# Altium schematic sheet 1_P1.schdoc
size 426 x 304 mm; Symbol: Sheet-Symbol_A3; Device: Sheet-Symbol_A3; Convert to PCB: yes; Add into BOM: yes; @Project Name: Catch5Yeah; @Page Count: 1; @Update Date: 2022-01-23; @Create Date: 2021-12-05; @Schematic Name: Schematic1; Company: 深圳嘉立创科技发展有限公司; Drawed: 嘉立创EDA; Reviewed: 嘉立创EDA; Version: V0.1; Page Size: A3; Part Number: JLCPCB-001; @Page No: 1
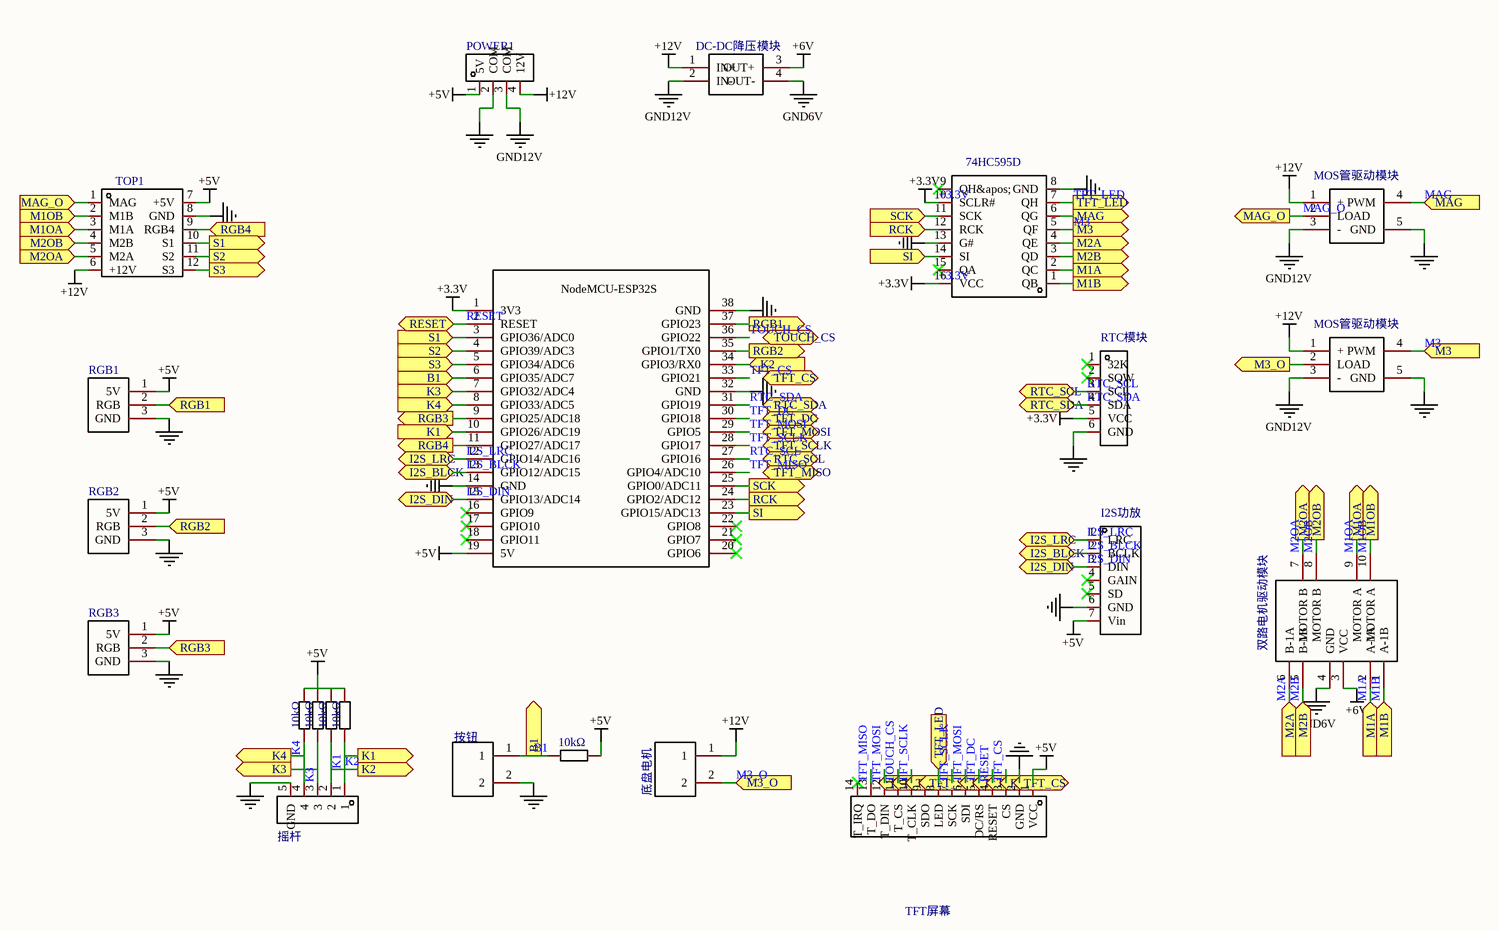
[diagram p0: 1_P1.schdoc]

## Parts
B1  按钮  [CONN-TH_2P-P2.00_PH-2A_C2319]
H2  I2S功放  [HDR-TH_7P-P2.54-V-F]
KEYPAD1  摇杆  [CONN-TH_5P-P2.00_PH-5A]
M3  底盘电机  [CONN-TH_2P-P2.00_PH-2A_C2319]
P5  RTC模块  [HDR-TH_6P-P2.54-V-F]
POWER1  开关电源接线柱  [CONN-TH_DB125-3.81-4P]  (value not drawn)
R1  value 10kΩ  [R0603]  (hidden comment: RC0603FR-0710KL)
R2  value 10kΩ  [R0603]  (hidden comment: RC0603FR-0710KL)
R3  value 10kΩ  [R0603]  (hidden comment: RC0603FR-0710KL)
R4  value 10kΩ  [R0603]  (hidden comment: RC0603FR-0710KL)
R5  value 10kΩ  [R0603]  (hidden comment: RC0603FR-0710KL)
RGB1  RGB1  [CONN-TH_12P-P2.00-H-W4.8_PH-3A]
RGB2  RGB2  [CONN-TH_12P-P2.00-H-W4.8_PH-3A]
RGB3  RGB3  [CONN-TH_12P-P2.00-H-W4.8_PH-3A]
SCREEN1  TFT屏幕  [HDR-TH_14P-P2.54-V-M]
TOP1  顶盖  [CONN-TH_12P-P2.00_PHD-2X6P]  (value not drawn)
U1  NodeMCU-32S  [ESP32S2-12K_1]  (value not drawn)
U15  74HC595D  [SOIC-16_L9.9-W3.9-P1.27-LS6.0-BL]
U16  双路电机驱动模块  [双路电机驱动模块]
U17  DC-DC降压模块  [DC-DC降压模块]
U18  MOS管驱动模块  [MOS管模块]
U19  MOS管驱动模块  [MOS管模块]

## Ports
B1 (in), B1 (out), I2S_BLCK (bidir), I2S_DIN (bidir), I2S_LRC (bidir), K1 (in), K1 (out), K2 (in), K2 (out), K3 (in), K3 (out), K4 (in), K4 (out), M1A (in), M1A (out), M1B (in), M1B (out), M1OA (in), M1OA (out), M1OB (in), M1OB (out), M2A (in), M2A (out), M2B (in), M2B (out), M2OA (in), M2OA (out), M2OB (in), M2OB (out), M3 (in), M3 (out), M3_O (in), M3_O (out), MAG (in), MAG (out), MAG_O (in), MAG_O (out), RCK (in), RCK (out), RESET (bidir), RGB1 (in), RGB1 (out), RGB2 (in), RGB2 (out), RGB3 (in), RGB3 (out), RGB4 (in), RGB4 (out), RTC_SCL (bidir), RTC_SDA (bidir), S1 (in), S1 (out), S2 (in), S2 (out), S3 (in), S3 (out), SCK (in), SCK (out), SI (in), SI (out), TFT_CS (bidir), TFT_DC (bidir), TFT_LED (in), TFT_LED (out), TFT_MISO (bidir), TFT_MOSI (bidir), TFT_SCLK (bidir), TOUCH_CS (bidir)

## Nets
+3.3V: P5.5(VCC) U1.1(3V3) U15.10(SCLR#) U15.16(VCC)
+5V: H2.7(Vin) POWER1.1(5V) R1.2 R2.2 R3.2 R4.2 R5.2 RGB1.1(5V) RGB2.1(5V) RGB3.1(5V) SCREEN1.1(VCC) TOP1.7(+5V) U1.19(5V)
+6V: U16.3(VCC) U17.3(OUT+)
+12V: M3.1 POWER1.4(12V) TOP1.6(+12V) U17.1(IN+) U18.1(+) U19.1(+)
GND: B1.2 H2.6(GND) KEYPAD1.5(GND) P5.6(GND) POWER1.2(COM) RGB1.3(GND) RGB2.3(GND) RGB3.3(GND) SCREEN1.2(GND) TOP1.8(GND) U1.14(GND) U1.32(GND) U1.38(GND) U15.8(GND) U15.13(G#) U18.5(GND) U19.5(GND)
GND6V: U16.4(GND) U17.4(OUT-)
GND12V: POWER1.3(COM) U17.2(IN-) U18.3(-) U19.3(-)
B1: B1.1 R5.1 U1.6(GPIO35/ADC7) ; port B1
I2S_BLCK: H2.2(BCLK) U1.13(GPIO12/ADC15) ; port I2S_BLCK
I2S_DIN: H2.3(DIN) U1.15(GPIO13/ADC14) ; port I2S_DIN
I2S_LRC: H2.1(LRC) U1.12(GPIO14/ADC16) ; port I2S_LRC
K1: KEYPAD1.1 KEYPAD1.2 R3.1 R4.1 U1.10(GPIO26/ADC19) U1.34(GPIO3/RX0) ; port K2, port K1  [also labelled K2]
K3: KEYPAD1.3 R2.1 U1.7(GPIO32/ADC4) ; port K3
K4: KEYPAD1.4 R1.1 U1.8(GPIO33/ADC5) ; port K4
M1A: U15.2(QC) U16.2(A-1A) ; port M1A
M1B: U15.1(QB) U16.1(A-1B) ; port M1B
M1OA: TOP1.3(M1A) U16.9(MOTOR_A) ; port M1OA
M1OB: TOP1.2(M1B) U16.10(MOTOR_A) ; port M1OB
M2A: U15.4(QE) U16.6(B-1A) ; port M2A
M2B: U15.3(QD) U16.5(B-1B) ; port M2B
M2OA: TOP1.5(M2A) U16.7(MOTOR_B) ; port M2OA
M2OB: TOP1.4(M2B) U16.8(MOTOR_B) ; port M2OB
M3: U15.5(QF) U19.4(PWM) ; port M3
M3_O: M3.2 U19.2(LOAD) ; port M3_O
MAG: U15.6(QG) U18.4(PWM) ; port MAG
MAG_O: TOP1.1(MAG) U18.2(LOAD) ; port MAG_O
RCK: U1.24(GPIO2/ADC12) U15.12(RCK) ; port RCK
RESET: SCREEN1.4(RESET) U1.2(RESET) ; port RESET
RGB1: RGB1.2(RGB) U1.37(GPIO23) ; port RGB1
RGB2: RGB2.2(RGB) U1.35(GPIO1/TX0) ; port RGB2
RGB3: RGB3.2(RGB) U1.9(GPIO25/ADC18) ; port RGB3
RGB4: TOP1.9(RGB4) U1.11(GPIO27/ADC17) ; port RGB4
RTC_SCL: P5.3(SCL) U1.27(GPIO16) ; port RTC_SCL
RTC_SDA: P5.4(SDA) U1.31(GPIO19) ; port RTC_SDA
S1: TOP1.10(S1) U1.3(GPIO36/ADC0) ; port S1
S2: TOP1.11(S2) U1.4(GPIO39/ADC3) ; port S2
S3: TOP1.12(S3) U1.5(GPIO34/ADC6) ; port S3
SCK: U1.25(GPIO0/ADC11) U15.11(SCK) ; port SCK
SI: U1.23(GPIO15/ADC13) U15.14(SI) ; port SI
TFT_CS: SCREEN1.3(CS) U1.33(GPIO21)
TFT_DC: SCREEN1.5(DC/RS) U1.30(GPIO18)
TFT_LED: SCREEN1.8(LED) U15.7(QH) ; port TFT_LED
TFT_MISO: SCREEN1.13(T_DO) U1.26(GPIO4/ADC10)
TFT_MOSI: SCREEN1.6(SDI) SCREEN1.12(T_DIN) U1.29(GPIO5)
TFT_SCLK: SCREEN1.7(SCK) SCREEN1.10(T_CLK) U1.28(GPIO17)
TOUCH_CS: SCREEN1.11(T_CS) U1.36(GPIO22)

Not connected (* = marked no-connect by the designer): H2 4(GAIN)* 5(SD)*; P5 1(32K)* 2(SQW)*; SCREEN1 9(SDO)* 14(T_IRQ)*; U1 16(GPIO9)* 17(GPIO10)* 18(GPIO11)* 20(GPIO6)* 21(GPIO7)* 22(GPIO8)*; U15 9(QH&apos;)* 15(QA)*

## Notes on the sheet
- 1
- 2
- 3
- 4
- 5
- 6
- A
- B
- C
- Schematic
- Schematic1
- Create Date
- Update Date
- 2022-01-23
- 2021-12-05
- D
- Reviewed
- Drawed
- 嘉立创EDA
- Part Number
- Catch5Yeah
- JLCPCB-001
- VER
- SIZE
- PAGE
- OF
- V0.1
- A3
- 深圳嘉立创科技发展有限公司
- (in symbol NodeMCU-32S) NodeMCU-ESP32S

## Library data of the parts
B1 M3 = 按钮: 系列:PH;连接器类型:接头;触头类型:公形引脚;间距:0.079; Manufacturer: BOOMELE(博穆精密); Manufacturer Part: PH-2A; Symbol: PH-2A_C2319; Add into BOM: yes; Connector Type: 接头; Pitch: 0.079; Number of Positions: 2; Device: 按钮; LCSC Part Name: PH-2A 2P 脚距2.0mm 直插; Supplier Part: C2319; LCSC Stock: 173953; LCSC On Sale: 1; Supplier Footprint: 插件; Price: 0.027; JLCPCB Part Class: Extended Part; JLCPCB Stock: 24500; JLCPCB On Sale: 1; Datasheet: https://atta.szlcsc.com/upload/public/pdf/source/20151208/1457707613620.pdf; Supplier: LCSC; Convert to PCB: yes; Series: PH; Contact Type: 公形引脚; Number of Rows: 1; Row Spacing: -; Mounting Type: 通孔; Contact Material: -
  B1: Name: 按钮
  M3: Name: 底盘电机
H2 = I2S功放: 间距:2.54mm;行距:-;触头镀层:-;触头材质:黄铜;安装类型:直插;塑高:-;总孔位数:7;排数:1;; Manufacturer: Ckmtw(灿科盟); Manufacturer Part: B-2200S07P-A120; Symbol: 220S-1*7P H=8.5MM Ytype Gold-plated; Add into BOM: yes; Pitch: 2.54mm; Number of Holes: 7; Device: I2S功放; LCSC Part Name: 排母 1*7P 2.54mm 直插; Supplier Part: C124418; LCSC Stock: 8812; LCSC On Sale: 1; Supplier Footprint: Through Hole,P=2.54mm; Price: 0.692; JLCPCB Part Class: Extended Part; JLCPCB Stock: 4903; JLCPCB On Sale: 1; Datasheet: https://atta.szlcsc.com/upload/public/pdf/source/20170821/C124418_1503303326113901572.pdf; Supplier: LCSC; Convert to PCB: yes; Row Spacing: -; Contact Plating: -; Contact Material: 黄铜; Mounting Type: 直插; Insulation Height: -; Number of Rows: 1
KEYPAD1 = 摇杆: 系列:PH;连接器类型:接头;触头类型:公形引脚;间距:0.079; Manufacturer: BOOMELE(博穆精密); Symbol: PH-5A; Add into BOM: yes; Connector Type: 接头; Pitch: 0.079; Number of Positions: 5; Device: 摇杆; LCSC Part Name: PH-5A 5P 脚距2.0mm   直插; Supplier Part: C2322; Manufacturer Part: PH-5A; LCSC Stock: 39068; LCSC On Sale: 1; Supplier Footprint: Through Hole; Price: 0.071; JLCPCB Part Class: Extended Part; JLCPCB Stock: 30950; JLCPCB On Sale: 1; Datasheet: https://atta.szlcsc.com/upload/public/pdf/source/20151118/1457707579352.pdf; Supplier: LCSC; Convert to PCB: yes; Series: PH; Contact Type: 公形引脚; Number of Rows: 1; Row Spacing: -; Mounting Type: 通孔; Contact Material: -
P5 = RTC模块: 间距:2.54mm;行距:-;触头镀层:-;触头材质:-;安装类型:直插;塑高:-;总孔位数:6;排数:1;; Manufacturer: BOOMELE(博穆精密); Manufacturer Part: 2.54-1*6P母; Symbol: Header-Female-2.54_1x6; Add into BOM: yes; Pitch: 2.54mm; Number of Holes: 6; Device: RTC模块; LCSC Part Name: 1x6P 2.54mm; Supplier Part: C40877; LCSC Stock: 21365; LCSC On Sale: 1; Supplier Footprint: 插件,P=2.54mm; Price: 0.36; JLCPCB Part Class: Extended Part; JLCPCB Stock: 7040; JLCPCB On Sale: 1; Datasheet: https://atta.szlcsc.com/upload/public/pdf/source/20151109/1457707559772.pdf; Supplier: LCSC; Convert to PCB: yes; Row Spacing: -; Contact Plating: -; Contact Material: -; Mounting Type: 直插; Insulation Height: -; Number of Rows: 1
POWER1 = 开关电源接线柱: 额定电流:10A;线规 - mm²:0.5~1;工作温度范围:-40℃~+105℃;额定电压:300V;颜色:绿色;安装方式:直针;间距:3.81mm;排数:1;线规 - AWG:16~26;每排PIN数:4;; Manufacturer: DIBO(地博电子); Manufacturer Part: DB125-3.81-4P-GN; Symbol: DB125-3.81-4P; Add into BOM: yes; Current Rating (Max): 10A; Wire Gauge - mm?: 0.5~1; Voltage Rating (Max): 300V; Mounting Sytle: 直针; Pitch: 3.81mm; Wire Gauge - AWG: 16~26; Number of PINs Per Row: 4; Device: 开关电源接线柱; LCSC Part Name: DB125-3.81-4P-GN; Supplier Part: C395880; LCSC Stock: 842; LCSC On Sale: 1; Supplier Footprint: P=3.81mm; Price: 1.439; JLCPCB Part Class: Extended Part; JLCPCB Stock: 2187; JLCPCB On Sale: 1; Datasheet: https://atta.szlcsc.com/upload/public/pdf/source/20210728/C2858301_9913CD4664B5BAF8F216E1FE7B518C99.pdf; Supplier: LCSC; Convert to PCB: yes; Operating Temperature Range: -40℃~+105℃; Color: 绿色; Number of Rows: 1
R1-R5 = RC0603FR-0710KL: 精度:±1%;温度系数:±100ppm/℃;阻值:10kΩ;功率:100mW;最大工作电压:75V;工作温度范围:-55℃~+155℃;; Manufacturer: YAGEO(国巨); Add into BOM: yes; Tolerance: ±1%; Power(Watts): 100mW; Overload Voltage (Max): 75V; Symbol: RC0603FR-0710KL; Device: RC0603FR-0710KL; LCSC Part Name: 10kΩ ±1%; Supplier Part: C98220; Manufacturer Part: RC0603FR-0710KL; LCSC Stock: 10690989; LCSC On Sale: 1; Supplier Footprint: 0603; Price: 0.008; JLCPCB Part Class: Extended Part; JLCPCB Stock: 5235250; JLCPCB On Sale: 1; Datasheet: https://atta.szlcsc.com/upload/public/pdf/source/20170522/1495423494387.pdf; Supplier: LCSC; Convert to PCB: yes; Temperature Coefficient: ±100ppm/℃; Operating Temperature Range: -55℃~+155℃
RGB1-RGB3 = RGB: 系列:PH;连接器类型:接头;触头类型:公形引脚;间距:0.079; Manufacturer: BOOMELE(博穆精密); Manufacturer Part: PH-3A; Symbol: PH-3A RHOS; Add into BOM: yes; Connector Type: 接头; Pitch: 0.079; Number of Positions: 3; Device: RGB; LCSC Part Name: PH-3A 3P脚距2.0mm  直插; Supplier Part: C2320; LCSC Stock: 40099; LCSC On Sale: 1; Supplier Footprint: 插件; Price: 0.036; JLCPCB Part Class: Extended Part; JLCPCB Stock: 41950; JLCPCB On Sale: 1; Datasheet: https://atta.szlcsc.com/upload/public/pdf/source/20151118/1457707579328.pdf; Supplier: LCSC; Convert to PCB: yes; Series: PH; Contact Type: 公形引脚; Number of Rows: 1; Row Spacing: -; Mounting Type: 通孔; Contact Material: -
  RGB1: Name: RGB1
  RGB2: Name: RGB2
  RGB3: Name: RGB3
SCREEN1 = TFT屏幕: 额定电压:250V;额定电流:3A;安装类型:直插;圆针/方针:方针;塑高:2.54mm;配合针长度:6mm;工作温度范围:-40℃~+105℃;排数:1;总PIN位数:14;端接针长度:3mm;间距:2.54mm;触头材质:-;行距:-;插针结构:1x14;; Manufacturer: kinghelm(金航标); Symbol: KH-A2541WV-14P; Add into BOM: yes; Voltage Rating (Max): 250V; Current Rating (Max): 3A; Circluar Pins/Square Pins: 方针; Pitch: 2.54mm; Pin Structure: 1x14; Device: TFT屏幕; LCSC Part Name: 1x14P 2.54mm; Supplier Part: C2833335; Manufacturer Part: KH-A2541WV-14P; LCSC Stock: 1760; LCSC On Sale: 1; Supplier Footprint: 插件,P=2.54mm; Price: 1.978; Datasheet: https://atta.szlcsc.com/upload/public/pdf/source/20210520/C2833335_8D16F82F4E0EB2F3FF64C01D240ACA26.pdf; Supplier: LCSC; Convert to PCB: yes; Mounting Type: 直插; Operating Temperature Range: -40℃~+105℃; Insulation Height: 2.54mm; Length of Mating Pin: 6mm; Number of Rows: 1; Number of Pins: 14; Length of End Connection Pin: 3mm; Contact Material: -; Row Spacing: -
TOP1 = 顶盖: 系列:PHD;连接器类型:接头;触头类型:公形引脚;间距:0.079; Manufacturer: BOOMELE(博穆精密); Manufacturer Part: PHD-2*6A; Symbol: PHD-2x6A; Add into BOM: yes; Connector Type: 接头; Pitch: 0.079; Number of Positions: 12; Device: 顶盖; LCSC Part Name: PHD-2*6P ，12P，间距2.0mm 直针; Supplier Part: C58103; LCSC Stock: 1150; LCSC On Sale: 1; Supplier Footprint: 插件; Price: 0.35; JLCPCB Part Class: Extended Part; JLCPCB Stock: 1270; JLCPCB On Sale: 1; Datasheet: https://atta.szlcsc.com/upload/public/pdf/source/20151126/1457707591005.pdf; Supplier: LCSC; Convert to PCB: yes; Series: PHD; Contact Type: 公形引脚; Number of Rows: 2; Row Spacing: 0.079; Mounting Type: 通孔; Contact Material: 磷青铜
U1 = NodeMCU-32S: Symbol: NodeMCU-ESP32; Convert to PCB: yes; Device: NodeMCU-32S; Add into BOM: yes
U15 = 74HC595D: 输出类型:-;元件数:-;每元件位数:-;逻辑电路的归属系列:-;逻辑类型:-;; Manufacturer: TOSHIBA(东芝); Symbol: 74HC595D_C431479; Add into BOM: yes; Device: 74HC595D; LCSC Part Name: 74HC595D; Supplier Part: C431479; Manufacturer Part: 74HC595D; LCSC Stock: 104; LCSC On Sale: 1; Supplier Footprint: SOIC-16; Price: 0.837; JLCPCB Part Class: Extended Part; JLCPCB Stock: 6030; JLCPCB On Sale: 1; Datasheet: https://atta.szlcsc.com/upload/public/pdf/source/20190920/C431479_35AD716FF5894FB7E9B0D7A2C001D0DE.pdf; Supplier: LCSC; Convert to PCB: yes; Output Type: -; Number of Elements: -; Number of Bits per Element: -; Function: -; Series: -; Logic Type: -; Voltage - Supply: -; Operating Temperature: -
U16 = 双路电机驱动模块: Convert to PCB: yes; Symbol: 双路电机驱动模块; Device: 双路电机驱动模块; Add into BOM: yes
U17 = DC-DC降压模块: Convert to PCB: yes; Symbol: DC-DC降压模块; Device: DC-DC降压模块; Add into BOM: yes
U18 U19 = MOS管驱动模块: Convert to PCB: yes; Symbol: MOS管模块; Device: MOS管驱动模块; Add into BOM: yes